# EAGLE schematic ai_ft232rl_breakout (EAGLE 6.4)
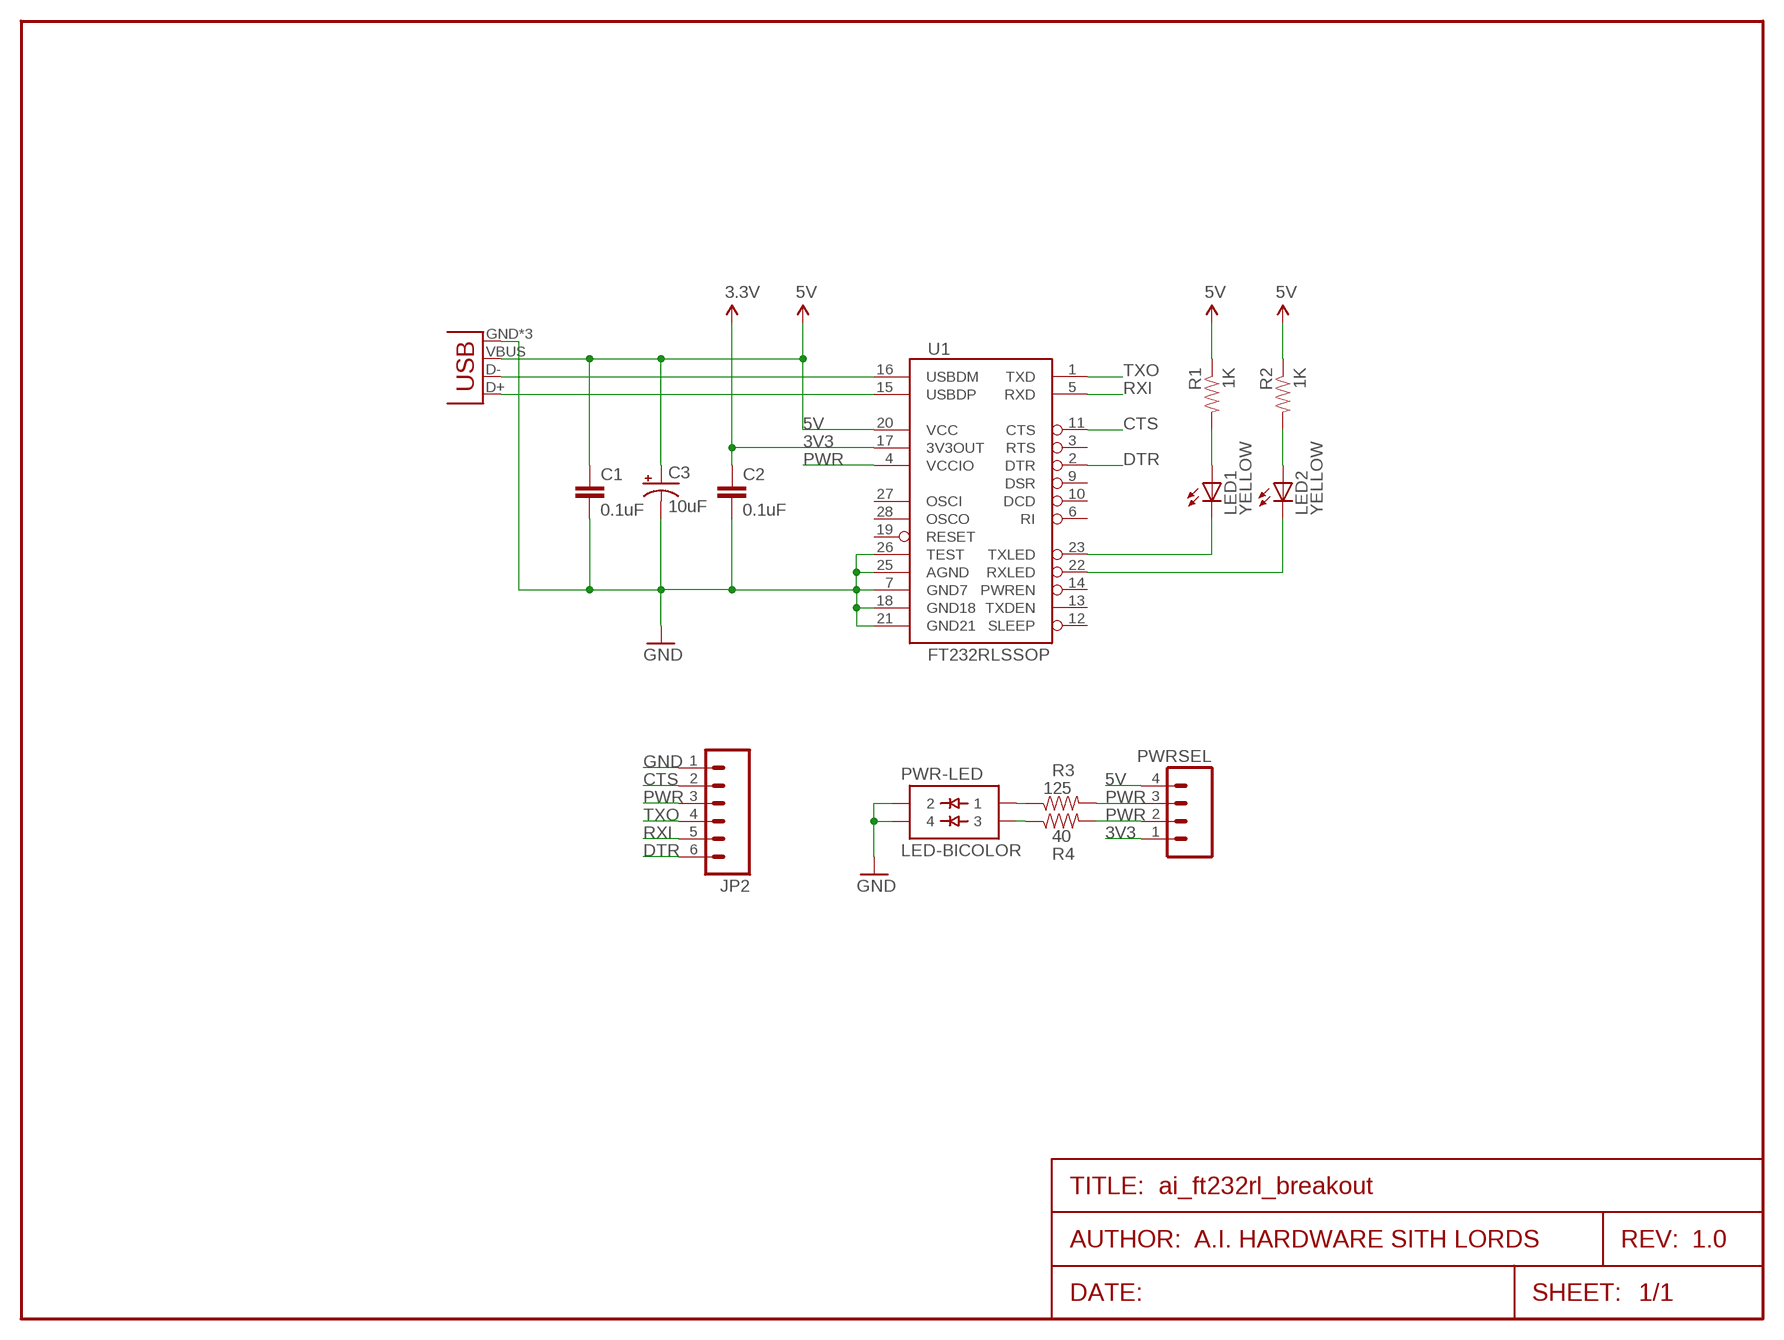
[diagram p0: schematic, sheet 1]
FRAME1 (FRAME-LETTER): AUTHOR: A.I. HARDWARE SITH LORDS; REV: 1.0

## Parts
C1  0.1uF  CAP0805  [0805]
C2  0.1uF  CAP0805  [0805]
C3  10uF  CAP_POL1206-KIT  [EIA3216-KIT]
JP2  M06LONGPADS  [1X06_LONGPADS]
LED1  YELLOW  LED-RED0603  [LED-0603]
LED2  YELLOW  LED-GREEN0603  [LED-0603]
PWR-LED  LED-BICOLOR  [LED-BICOLOR-SMD]
PWRSEL  M04PTH  [1X04]
R1  1K  RESISTOR0805-RES  [0805]
R2  1K  RESISTOR0805-RES  [0805]
R3  125  RESISTOR0805-RES  [0805]
R4  40  RESISTOR0805-RES  [0805]
U1  FT232RLSSOP  [SSOP28DB]
USB  USB-MICROB  [USB-MICROB]

## Nets
3V3: C2.1 PWRSEL.1 U1.17(3V3OUT) ; supply symbol labelled 3.3V
5V: C1.1 C3.A(+) PWRSEL.4 R1.1 R2.1 U1.20(VCC) USB.VBUS
CTS: JP2.2 U1.11(CTS)
DTR: JP2.6 U1.2(DTR)
GND: C1.2 C2.2 C3.C(-) JP2.1 PWR-LED.2 PWR-LED.4 U1.7(GND7) U1.18(GND18) U1.21(GND21) U1.25(AGND) U1.26(TEST) USB.GND USB.MT1(GND) USB.MT2(GND)
N$1: LED1.C U1.23(TXLED)
N$2: LED2.C U1.22(RXLED)
N$3: U1.16(USBDM) USB.D-
N$4: U1.15(USBDP) USB.D+
N$5: LED2.A R2.2
N$6: LED1.A R1.2
N$7: PWR-LED.1 R3.1
N$8: PWRSEL.3 R3.2
N$11: PWR-LED.3 R4.1
PWR: JP2.3 PWRSEL.2 R4.2 U1.4(VCCIO)
RXI: JP2.5 U1.5(RXD)
TXO: JP2.4 U1.1(TXD)
Unconnected: U1.3(RTS) U1.6(RI) U1.9(DSR) U1.10(DCD) U1.12(SLEEP) U1.13(TXDEN) U1.14(PWREN) U1.19(RESET) U1.27(OSCI) U1.28(OSCO)

## Library data of the parts
C1 C2 = SparkFun-Capacitors:CAP: Capacitor Standard 0603 ceramic capacitor, and 0.1" leaded capacitor.
C3 = SparkFun-Passives:CAP_POL: Capacitor Polarized These are standard SMD and PTH capacitors. Normally 10uF, 47uF, and 100uF in electrolytic and tantalum varieties. Always verify the external diameter of the through hole cap, it varies with capacity, voltage, and manufacturer. The EIA devices should be standard.
JP2 = SparkFun-Connectors:M06: Header 6 Standard 6-pin 0.1" header. Use with straight break away headers (SKU : PRT-00116), right angle break away headers (PRT-00553), swiss pins (PRT-00743), machine pins (PRT-00117), and female headers (PRT-00115). Molex polarized connector foot print use with SKU : PRT-08094 with associated crimp pins and housings. NOTES ON THE VARIANTS LOCK and LOCK_LONGPADS... This footprint was designed to help hold the alignment of a through-hole component (i.e. 6-pin header) while soldering it into place. You may notice that each hole has been shifted either up or down by 0.005 of an inch from it's more standard position (which is a perfectly straight line). This slight alteration caused the pins (the squares in the middle) to touch the edges of the holes. Because they are alternating, it causes a "brace" to hold the component in place. 0.005 has proven to be the perfect amount of "off-center" position when using our standard breakaway headers. Although looks a little odd when you look at the bare footprint, once you have a header in there, the alteration is very hard to notice. Also,if you push a header all the way into place, it is covered up entirely on the bottom side. This idea of altering the position of holes to aid alignment will be further integrated into the Sparkfun Library for other footprints. It can help hold any component with 3 or more connection pins.
LED1 = SparkFun-LED:LED-RED: Assorted Red LEDs LilyPad 1206- DIO-09912 1206- DIO-00809 0603- DIO-00819; PROD_ID: DIO-00819; VALUE: RED
LED2 = SparkFun-LED:LED-GREEN: Various green LEDs 0603- DIO-00821 LARGE- DIO-00862 LILYPAD- DIO-09910; PROD_ID: DIO-00821; VALUE: GREEN
PWR-LED = Acrobotic-LED:LED-BICOLOR
PWRSEL = SparkFun-Connectors:M04: Header 4 Standard 4-pin 0.1" header. Use with straight break away headers (SKU : PRT-00116), right angle break away headers (PRT-00553), swiss pins (PRT-00743), machine pins (PRT-00117), and female headers (PRT-00115). Molex polarized connector foot print use with SKU : PRT-08231 with associated crimp pins and housings. 1MM SMD Version SKU: PRT-10208
R1-R4 = SparkFun-Resistors:RESISTOR: Resistor Basic schematic elements and footprints for 0603, 1206, and PTH resistors.
U1 = SparkFun-DigitalIC:FT232RL: USB UART FT232RL 4th Generation USB UART (USB <-> Serial) Controller. Spark Fun Electronics SKU : COM-00650 Production SKU IC-00870; PROD_ID: IC-00870
USB = SparkFun-Connectors:USB: USB Connectors USB-B-PTH is fully proven SKU : PRT-00139/CONN-08278 USB-miniB is fully proven SKU : PRT-00587 USB-A-PCB is untested. USB-A-H is throughly reviewed, but untested. Spark Fun Electronics SKU : PRT-00437 USB-B-SMT is throughly reviewed, but untested. Needs silkscreen touching up. USB-A-S has not been used/tested USB-MB-H has not been used/tested USB-MICROB has been used. CONN-09505; PROD_ID: CONN-09505